# EAGLE schematic escape (EAGLE 9.5.1)
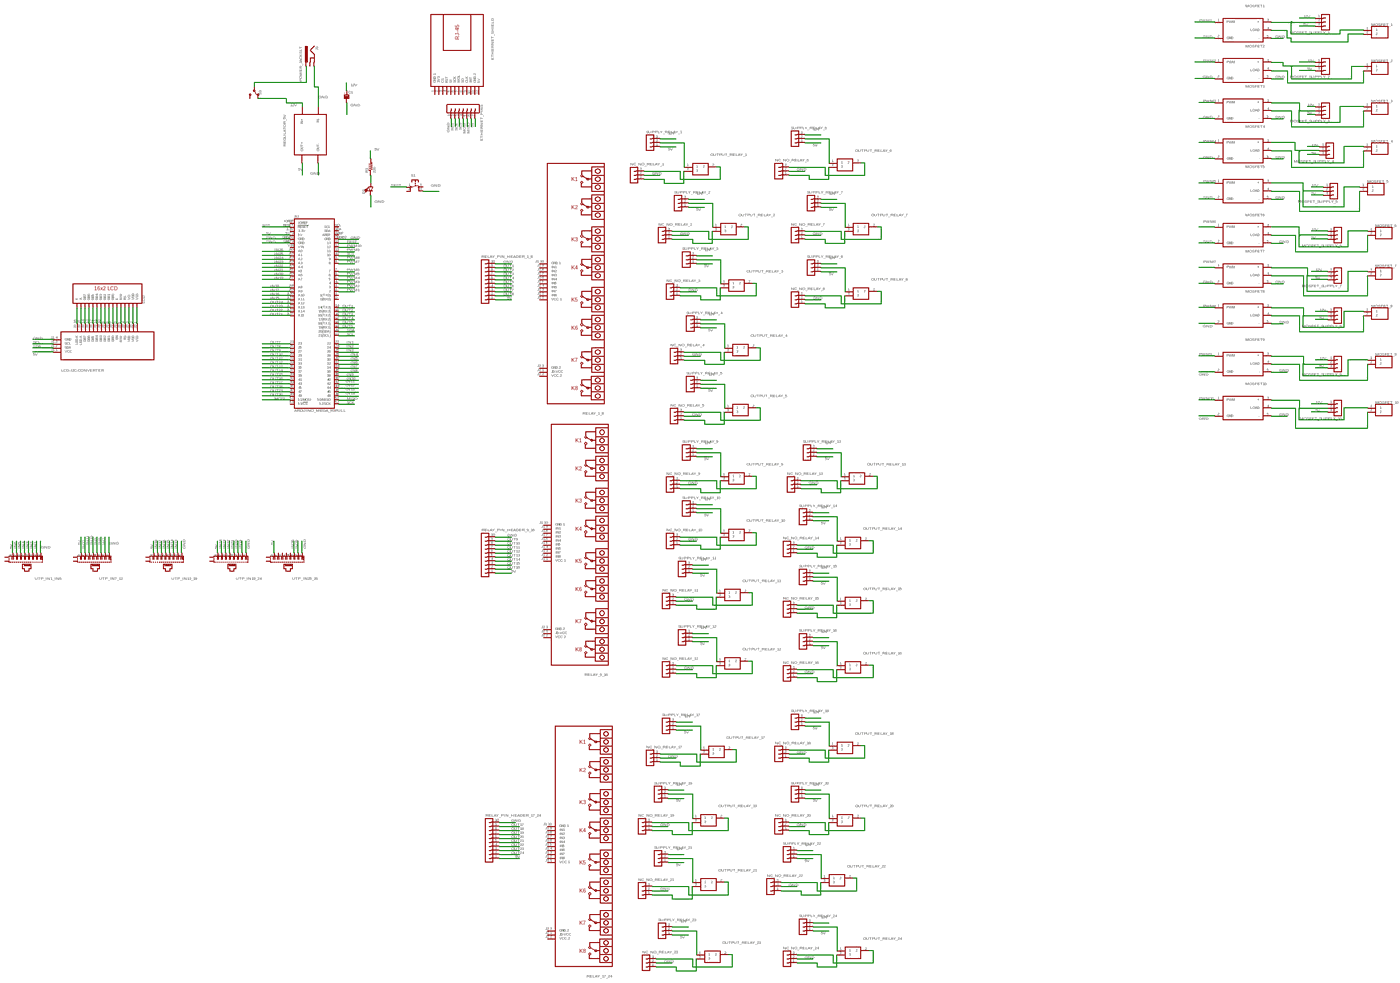
[diagram p0: schematic, sheet 1, overview]
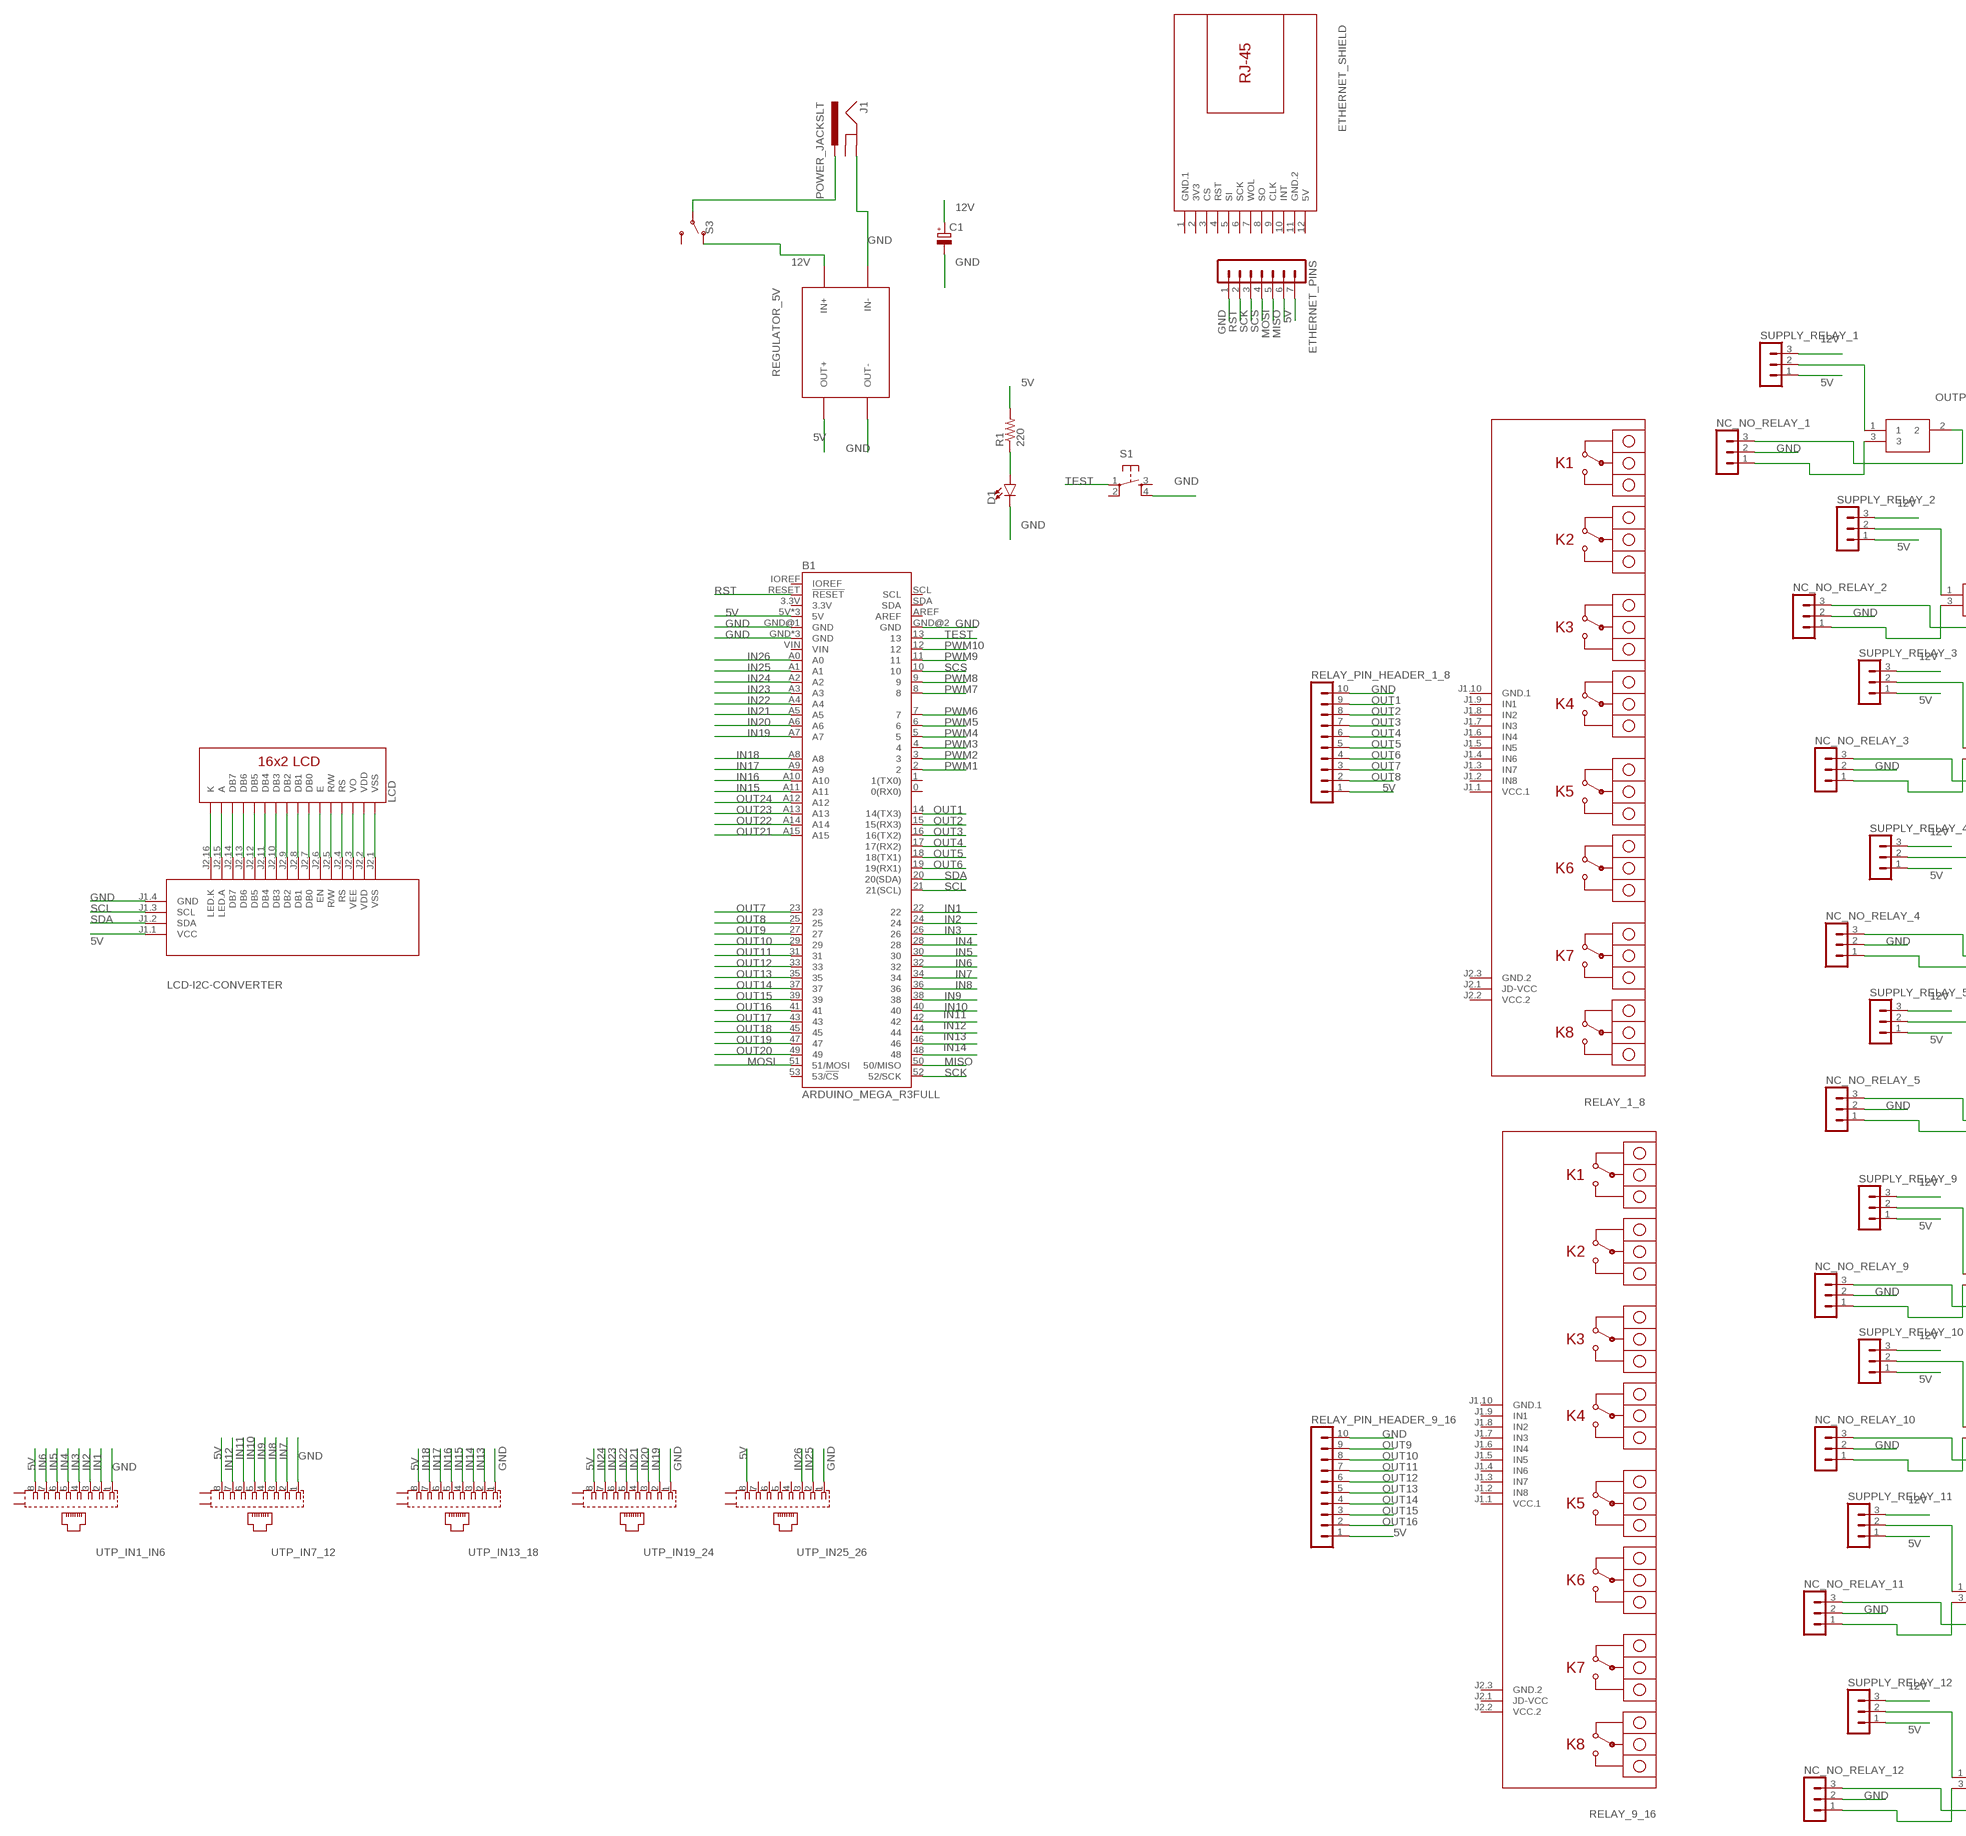
[diagram p1: schematic, sheet 1, part 1 of 4]
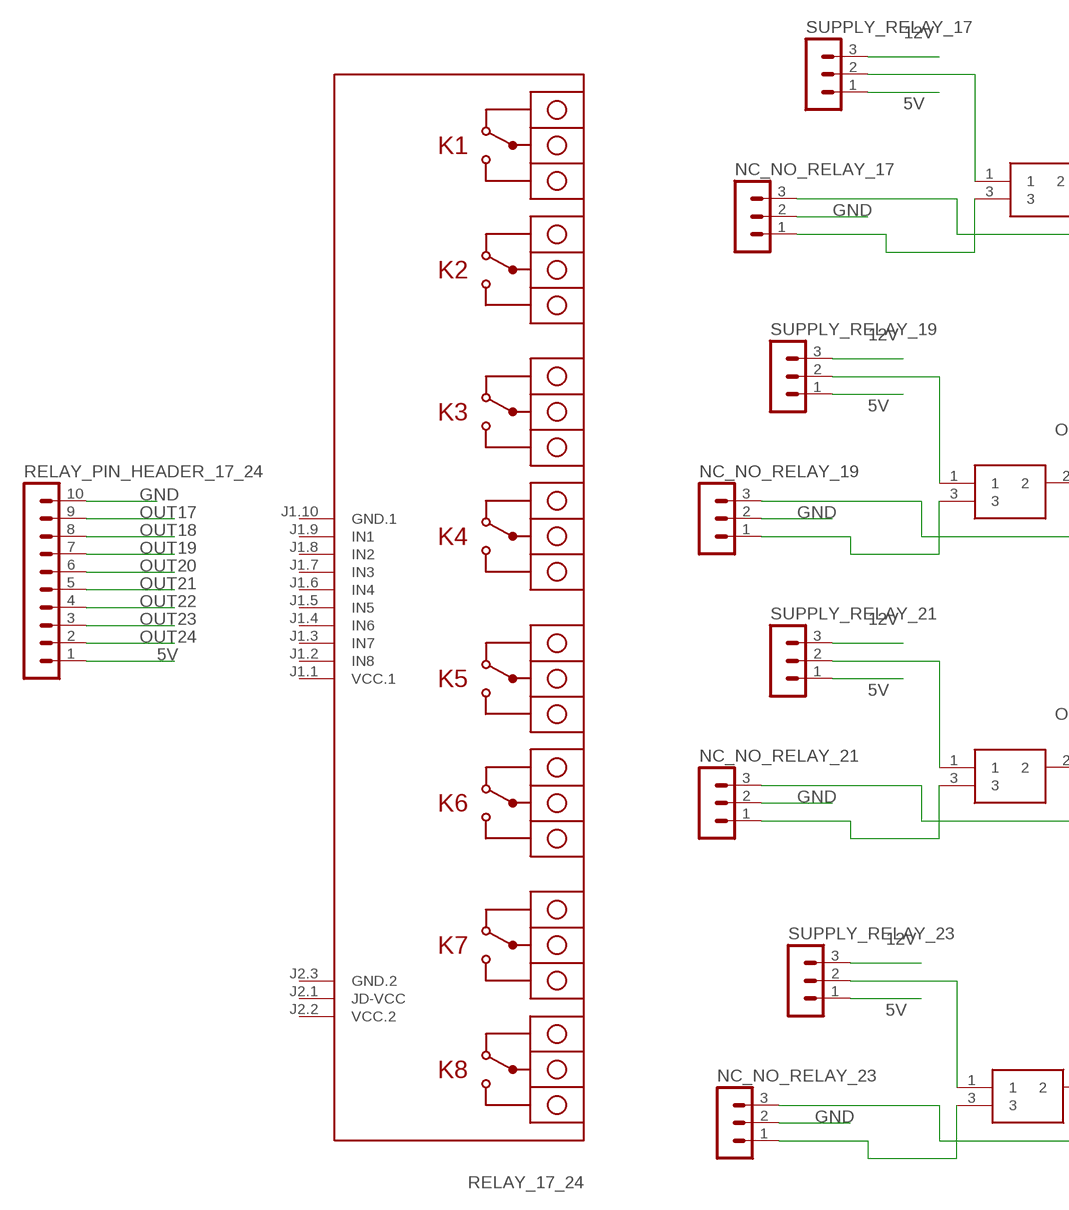
[diagram p2: schematic, sheet 1, part 2 of 4]
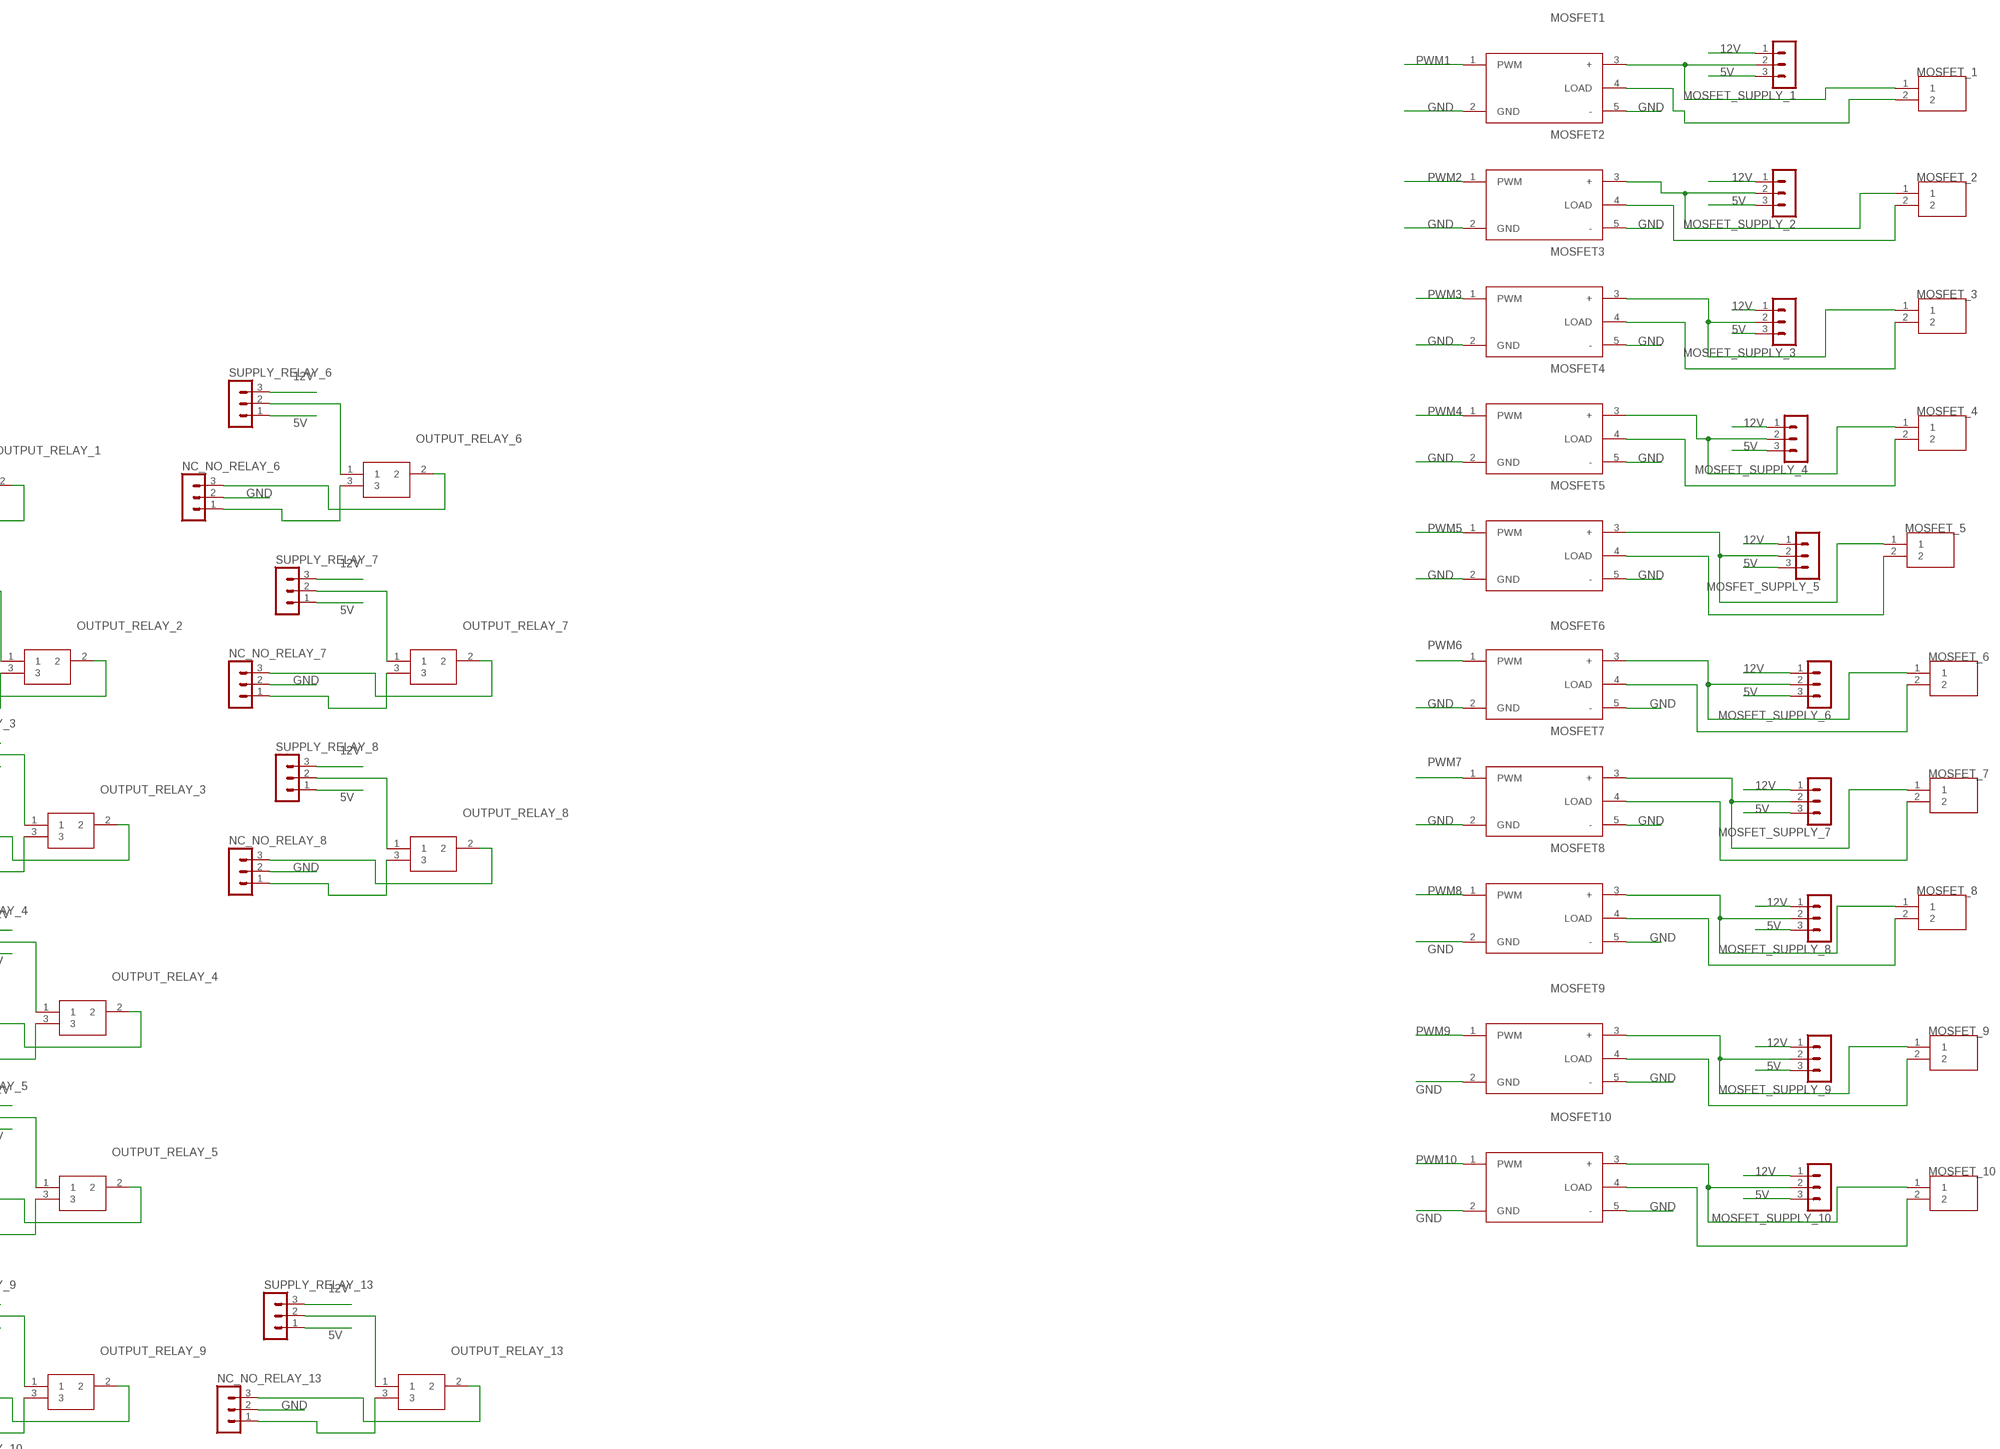
[diagram p3: schematic, sheet 1, part 3 of 4]
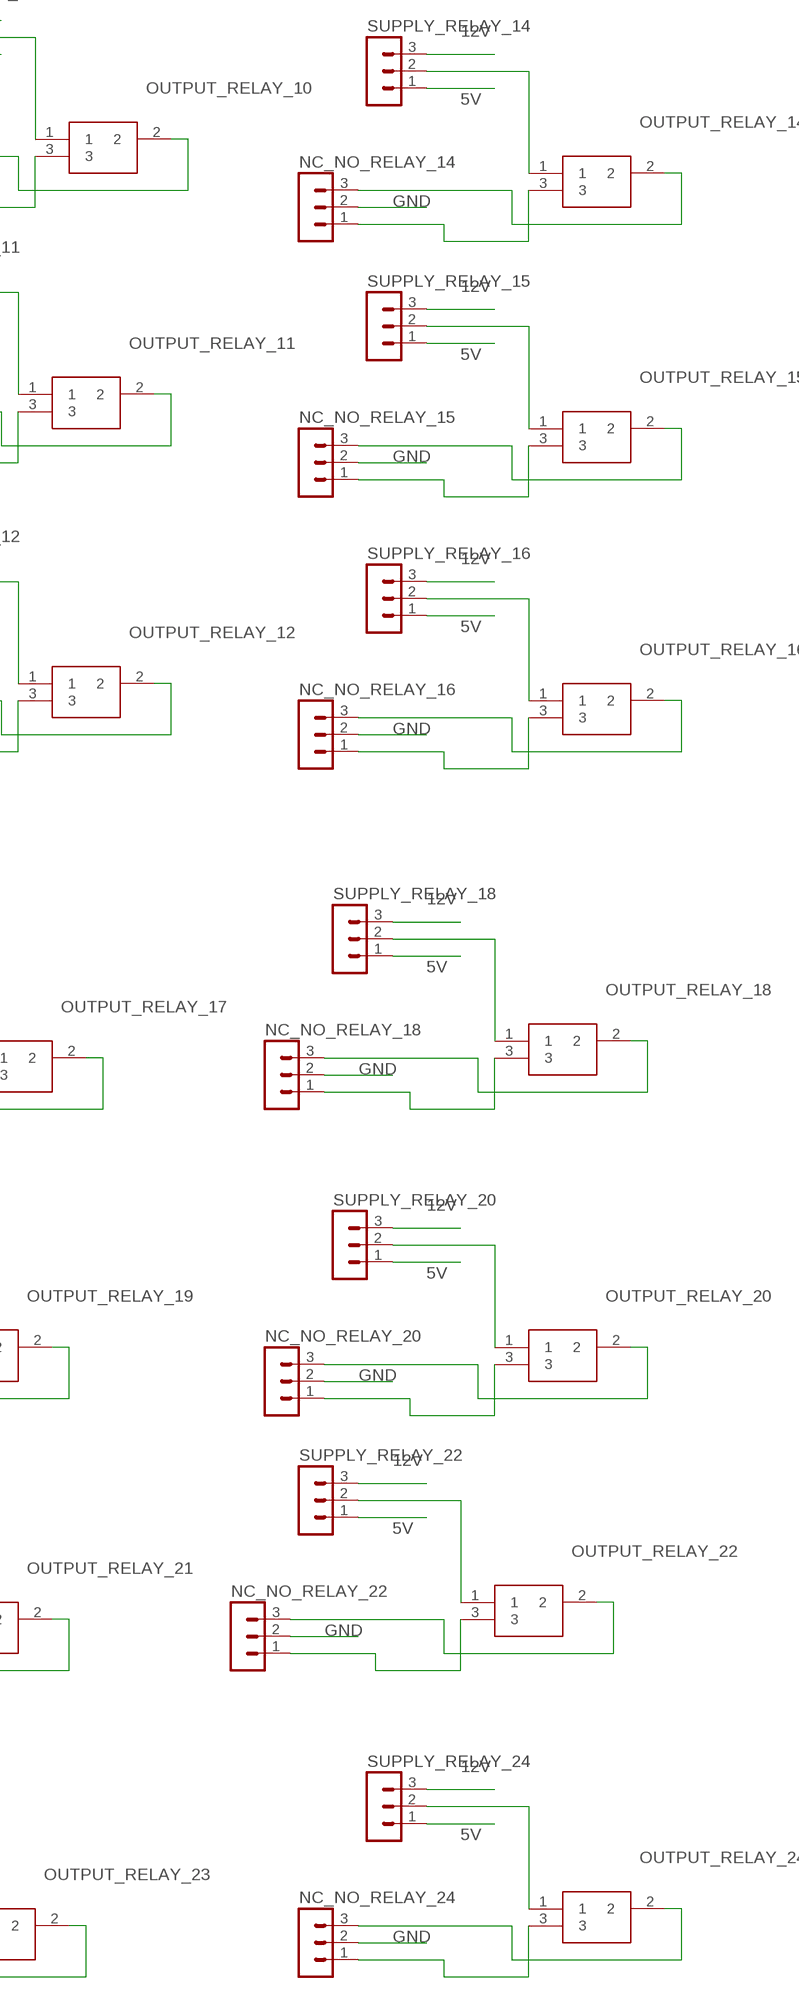
[diagram p4: schematic, sheet 1, part 4 of 4]

## Parts
B1  ARDUINO_MEGA_R3FULL  [ARDUINO_MEGA_NO_SILK]
C1  CPOL-EUE3.5-10  [E3,5-10]
D1  LED5MM  [LED_5MM]
ETHERNET_PINS  MA07-1  [MA07-1]
ETHERNET_SHIELD  ETHERNET-ENC28J60  [ETHERNET-ENC28J60]
J1  POWER_JACKSLT  [POWER_JACK_SLOT]
LCD  LCD-16X2NOSILK  [LCD-16X2_NOSILK]
MOSFET1  SAMACSYS_PARTS_FR120N-ISOLATED-MOSFET-MOD  [SAMACSYS_PARTS_FR120N-ISOLATED-MOSFET-MOD]
MOSFET2  SAMACSYS_PARTS_FR120N-ISOLATED-MOSFET-MOD  [SAMACSYS_PARTS_FR120N-ISOLATED-MOSFET-MOD]
MOSFET3  SAMACSYS_PARTS_FR120N-ISOLATED-MOSFET-MOD  [SAMACSYS_PARTS_FR120N-ISOLATED-MOSFET-MOD]
MOSFET4  SAMACSYS_PARTS_FR120N-ISOLATED-MOSFET-MOD  [SAMACSYS_PARTS_FR120N-ISOLATED-MOSFET-MOD]
MOSFET5  SAMACSYS_PARTS_FR120N-ISOLATED-MOSFET-MOD  [SAMACSYS_PARTS_FR120N-ISOLATED-MOSFET-MOD]
MOSFET6  SAMACSYS_PARTS_FR120N-ISOLATED-MOSFET-MOD  [SAMACSYS_PARTS_FR120N-ISOLATED-MOSFET-MOD]
MOSFET7  SAMACSYS_PARTS_FR120N-ISOLATED-MOSFET-MOD  [SAMACSYS_PARTS_FR120N-ISOLATED-MOSFET-MOD]
MOSFET8  SAMACSYS_PARTS_FR120N-ISOLATED-MOSFET-MOD  [SAMACSYS_PARTS_FR120N-ISOLATED-MOSFET-MOD]
MOSFET9  SAMACSYS_PARTS_FR120N-ISOLATED-MOSFET-MOD  [SAMACSYS_PARTS_FR120N-ISOLATED-MOSFET-MOD]
MOSFET10  SAMACSYS_PARTS_FR120N-ISOLATED-MOSFET-MOD  [SAMACSYS_PARTS_FR120N-ISOLATED-MOSFET-MOD]
MOSFET_1  TB006-508-02BE_TB006-508-02BE  [TB006-508-02BE_CUI_TB006-508-02BE]
MOSFET_2  TB006-508-02BE_TB006-508-02BE  [TB006-508-02BE_CUI_TB006-508-02BE]
MOSFET_3  TB006-508-02BE_TB006-508-02BE  [TB006-508-02BE_CUI_TB006-508-02BE]
MOSFET_4  TB006-508-02BE_TB006-508-02BE  [TB006-508-02BE_CUI_TB006-508-02BE]
MOSFET_5  TB006-508-02BE_TB006-508-02BE  [TB006-508-02BE_CUI_TB006-508-02BE]
MOSFET_6  TB006-508-02BE_TB006-508-02BE  [TB006-508-02BE_CUI_TB006-508-02BE]
MOSFET_7  TB006-508-02BE_TB006-508-02BE  [TB006-508-02BE_CUI_TB006-508-02BE]
MOSFET_8  TB006-508-02BE_TB006-508-02BE  [TB006-508-02BE_CUI_TB006-508-02BE]
MOSFET_9  TB006-508-02BE_TB006-508-02BE  [TB006-508-02BE_CUI_TB006-508-02BE]
MOSFET_10  TB006-508-02BE_TB006-508-02BE  [TB006-508-02BE_CUI_TB006-508-02BE]
MOSFET_SUPPLY_1  MA03-1  [MA03-1]
MOSFET_SUPPLY_2  MA03-1  [MA03-1]
MOSFET_SUPPLY_3  MA03-1  [MA03-1]
MOSFET_SUPPLY_4  MA03-1  [MA03-1]
MOSFET_SUPPLY_5  MA03-1  [MA03-1]
MOSFET_SUPPLY_6  MA03-1  [MA03-1]
MOSFET_SUPPLY_7  MA03-1  [MA03-1]
MOSFET_SUPPLY_8  MA03-1  [MA03-1]
MOSFET_SUPPLY_9  MA03-1  [MA03-1]
MOSFET_SUPPLY_10  MA03-1  [MA03-1]
NC_NO_RELAY_1  MA03-1  [MA03-1]
NC_NO_RELAY_2  MA03-1  [MA03-1]
NC_NO_RELAY_3  MA03-1  [MA03-1]
NC_NO_RELAY_4  MA03-1  [MA03-1]
NC_NO_RELAY_5  MA03-1  [MA03-1]
NC_NO_RELAY_6  MA03-1  [MA03-1]
NC_NO_RELAY_7  MA03-1  [MA03-1]
NC_NO_RELAY_8  MA03-1  [MA03-1]
NC_NO_RELAY_9  MA03-1  [MA03-1]
NC_NO_RELAY_10  MA03-1  [MA03-1]
NC_NO_RELAY_11  MA03-1  [MA03-1]
NC_NO_RELAY_12  MA03-1  [MA03-1]
NC_NO_RELAY_13  MA03-1  [MA03-1]
NC_NO_RELAY_14  MA03-1  [MA03-1]
NC_NO_RELAY_15  MA03-1  [MA03-1]
NC_NO_RELAY_16  MA03-1  [MA03-1]
NC_NO_RELAY_17  MA03-1  [MA03-1]
NC_NO_RELAY_18  MA03-1  [MA03-1]
NC_NO_RELAY_19  MA03-1  [MA03-1]
NC_NO_RELAY_20  MA03-1  [MA03-1]
NC_NO_RELAY_21  MA03-1  [MA03-1]
NC_NO_RELAY_22  MA03-1  [MA03-1]
NC_NO_RELAY_23  MA03-1  [MA03-1]
NC_NO_RELAY_24  MA03-1  [MA03-1]
OUTPUT_RELAY_1  SAMACSYS_PARTS_TB006-508-03BE  [SAMACSYS_PARTS_TB00650803BE]
OUTPUT_RELAY_2  SAMACSYS_PARTS_TB006-508-03BE  [SAMACSYS_PARTS_TB00650803BE]
OUTPUT_RELAY_3  SAMACSYS_PARTS_TB006-508-03BE  [SAMACSYS_PARTS_TB00650803BE]
OUTPUT_RELAY_4  SAMACSYS_PARTS_TB006-508-03BE  [SAMACSYS_PARTS_TB00650803BE]
OUTPUT_RELAY_5  SAMACSYS_PARTS_TB006-508-03BE  [SAMACSYS_PARTS_TB00650803BE]
OUTPUT_RELAY_6  SAMACSYS_PARTS_TB006-508-03BE  [SAMACSYS_PARTS_TB00650803BE]
OUTPUT_RELAY_7  SAMACSYS_PARTS_TB006-508-03BE  [SAMACSYS_PARTS_TB00650803BE]
OUTPUT_RELAY_8  SAMACSYS_PARTS_TB006-508-03BE  [SAMACSYS_PARTS_TB00650803BE]
OUTPUT_RELAY_9  SAMACSYS_PARTS_TB006-508-03BE  [SAMACSYS_PARTS_TB00650803BE]
OUTPUT_RELAY_10  SAMACSYS_PARTS_TB006-508-03BE  [SAMACSYS_PARTS_TB00650803BE]
OUTPUT_RELAY_11  SAMACSYS_PARTS_TB006-508-03BE  [SAMACSYS_PARTS_TB00650803BE]
OUTPUT_RELAY_12  SAMACSYS_PARTS_TB006-508-03BE  [SAMACSYS_PARTS_TB00650803BE]
OUTPUT_RELAY_13  SAMACSYS_PARTS_TB006-508-03BE  [SAMACSYS_PARTS_TB00650803BE]
OUTPUT_RELAY_14  SAMACSYS_PARTS_TB006-508-03BE  [SAMACSYS_PARTS_TB00650803BE]
OUTPUT_RELAY_15  SAMACSYS_PARTS_TB006-508-03BE  [SAMACSYS_PARTS_TB00650803BE]
OUTPUT_RELAY_16  SAMACSYS_PARTS_TB006-508-03BE  [SAMACSYS_PARTS_TB00650803BE]
OUTPUT_RELAY_17  SAMACSYS_PARTS_TB006-508-03BE  [SAMACSYS_PARTS_TB00650803BE]
OUTPUT_RELAY_18  SAMACSYS_PARTS_TB006-508-03BE  [SAMACSYS_PARTS_TB00650803BE]
OUTPUT_RELAY_19  SAMACSYS_PARTS_TB006-508-03BE  [SAMACSYS_PARTS_TB00650803BE]
OUTPUT_RELAY_20  SAMACSYS_PARTS_TB006-508-03BE  [SAMACSYS_PARTS_TB00650803BE]
OUTPUT_RELAY_21  SAMACSYS_PARTS_TB006-508-03BE  [SAMACSYS_PARTS_TB00650803BE]
OUTPUT_RELAY_22  SAMACSYS_PARTS_TB006-508-03BE  [SAMACSYS_PARTS_TB00650803BE]
OUTPUT_RELAY_23  SAMACSYS_PARTS_TB006-508-03BE  [SAMACSYS_PARTS_TB00650803BE]
OUTPUT_RELAY_24  SAMACSYS_PARTS_TB006-508-03BE  [SAMACSYS_PARTS_TB00650803BE]
R1  220  R-US_0207/10  [0207/10]
REGULATOR_5V  DIY-MODULES_DC-DC-STEP-DOWN-LM2596  [DIY-MODULES_DC-DC-STEP-DOWN-LM2596]
RELAY_1_8  RELAY-8-SRD  [RELAY-8-SRD]
RELAY_9_16  RELAY-8-SRD  [RELAY-8-SRD]
RELAY_17_24  RELAY-8-SRD  [RELAY-8-SRD]
RELAY_PIN_HEADER_1_8  MA10-1  [MA10-1]
RELAY_PIN_HEADER_9_16  MA10-1  [MA10-1]
RELAY_PIN_HEADER_17_24  MA10-1  [MA10-1]
S1  TAC_SWITCHPTH  [TACTILE-PTH]
S3  SWITCH-SPDT-PTH-11.6X4.0MM-LOCK  [SWITCH_SPDT_PTH_11.6X4.0MM_LOCK]
SUPPLY_RELAY_1  MA03-1  [MA03-1]
SUPPLY_RELAY_2  MA03-1  [MA03-1]
SUPPLY_RELAY_3  MA03-1  [MA03-1]
SUPPLY_RELAY_4  MA03-1  [MA03-1]
SUPPLY_RELAY_5  MA03-1  [MA03-1]
SUPPLY_RELAY_6  MA03-1  [MA03-1]
SUPPLY_RELAY_7  MA03-1  [MA03-1]
SUPPLY_RELAY_8  MA03-1  [MA03-1]
SUPPLY_RELAY_9  MA03-1  [MA03-1]
SUPPLY_RELAY_10  MA03-1  [MA03-1]
SUPPLY_RELAY_11  MA03-1  [MA03-1]
SUPPLY_RELAY_12  MA03-1  [MA03-1]
SUPPLY_RELAY_13  MA03-1  [MA03-1]
SUPPLY_RELAY_14  MA03-1  [MA03-1]
SUPPLY_RELAY_15  MA03-1  [MA03-1]
SUPPLY_RELAY_16  MA03-1  [MA03-1]
SUPPLY_RELAY_17  MA03-1  [MA03-1]
SUPPLY_RELAY_18  MA03-1  [MA03-1]
SUPPLY_RELAY_19  MA03-1  [MA03-1]
SUPPLY_RELAY_20  MA03-1  [MA03-1]
SUPPLY_RELAY_21  MA03-1  [MA03-1]
SUPPLY_RELAY_22  MA03-1  [MA03-1]
SUPPLY_RELAY_23  MA03-1  [MA03-1]
SUPPLY_RELAY_24  MA03-1  [MA03-1]
U$3  LCD-I2C-CONVERTER  [LCD-I2C-CONVERTER]
UTP_IN1_IN6  GLX-S-88M  [GLX-S-88M]
UTP_IN7_12  GLX-S-88M  [GLX-S-88M]
UTP_IN13_18  GLX-S-88M  [GLX-S-88M]
UTP_IN19_24  GLX-S-88M  [GLX-S-88M]
UTP_IN25_26  GLX-S-88M  [GLX-S-88M]

## Nets
5V: B1.5V B1.5V@1(5V) B1.5V@2(5V) ETHERNET_PINS.7 MOSFET_SUPPLY_1.3 MOSFET_SUPPLY_2.3 MOSFET_SUPPLY_3.3 MOSFET_SUPPLY_4.3 MOSFET_SUPPLY_5.3 MOSFET_SUPPLY_6.3 MOSFET_SUPPLY_7.3 MOSFET_SUPPLY_8.3 MOSFET_SUPPLY_9.3 MOSFET_SUPPLY_10.3 R1.2 REGULATOR_5V.OUT+ RELAY_PIN_HEADER_1_8.1 RELAY_PIN_HEADER_9_16.1 RELAY_PIN_HEADER_17_24.1 SUPPLY_RELAY_1.1 SUPPLY_RELAY_2.1 SUPPLY_RELAY_3.1 SUPPLY_RELAY_4.1 SUPPLY_RELAY_5.1 SUPPLY_RELAY_6.1 SUPPLY_RELAY_7.1 SUPPLY_RELAY_8.1 SUPPLY_RELAY_9.1 SUPPLY_RELAY_10.1 SUPPLY_RELAY_11.1 SUPPLY_RELAY_12.1 SUPPLY_RELAY_13.1 SUPPLY_RELAY_14.1 SUPPLY_RELAY_15.1 SUPPLY_RELAY_16.1 SUPPLY_RELAY_17.1 SUPPLY_RELAY_18.1 SUPPLY_RELAY_19.1 SUPPLY_RELAY_20.1 SUPPLY_RELAY_21.1 SUPPLY_RELAY_22.1 SUPPLY_RELAY_23.1 SUPPLY_RELAY_24.1 U$3.J1.1(VCC) UTP_IN1_IN6.8 UTP_IN7_12.8 UTP_IN13_18.8 UTP_IN19_24.8 UTP_IN25_26.8
12V: C1.+ MOSFET_SUPPLY_1.1 MOSFET_SUPPLY_2.1 MOSFET_SUPPLY_3.1 MOSFET_SUPPLY_4.1 MOSFET_SUPPLY_5.1 MOSFET_SUPPLY_6.1 MOSFET_SUPPLY_7.1 MOSFET_SUPPLY_8.1 MOSFET_SUPPLY_9.1 MOSFET_SUPPLY_10.1 REGULATOR_5V.IN+ S3.1(O) SUPPLY_RELAY_1.3 SUPPLY_RELAY_2.3 SUPPLY_RELAY_3.3 SUPPLY_RELAY_4.3 SUPPLY_RELAY_5.3 SUPPLY_RELAY_6.3 SUPPLY_RELAY_7.3 SUPPLY_RELAY_8.3 SUPPLY_RELAY_9.3 SUPPLY_RELAY_10.3 SUPPLY_RELAY_11.3 SUPPLY_RELAY_12.3 SUPPLY_RELAY_13.3 SUPPLY_RELAY_14.3 SUPPLY_RELAY_15.3 SUPPLY_RELAY_16.3 SUPPLY_RELAY_17.3 SUPPLY_RELAY_18.3 SUPPLY_RELAY_19.3 SUPPLY_RELAY_20.3 SUPPLY_RELAY_21.3 SUPPLY_RELAY_22.3 SUPPLY_RELAY_23.3 SUPPLY_RELAY_24.3
GND: B1.GND B1.GND@1(GND) B1.GND@2(GND) B1.GND@3(GND) B1.GND@4(GND) C1.- D1.K(C) ETHERNET_PINS.1 J1.GND@2(GND) MOSFET1.2(GND) MOSFET1.5(-) MOSFET2.2(GND) MOSFET2.5(-) MOSFET3.2(GND) MOSFET3.5(-) MOSFET4.2(GND) MOSFET4.5(-) MOSFET5.2(GND) MOSFET5.5(-) MOSFET6.2(GND) MOSFET6.5(-) MOSFET7.2(GND) MOSFET7.5(-) MOSFET8.2(GND) MOSFET8.5(-) MOSFET9.2(GND) MOSFET9.5(-) MOSFET10.2(GND) MOSFET10.5(-) NC_NO_RELAY_1.2 NC_NO_RELAY_2.2 NC_NO_RELAY_3.2 NC_NO_RELAY_4.2 NC_NO_RELAY_5.2 NC_NO_RELAY_6.2 NC_NO_RELAY_7.2 NC_NO_RELAY_8.2 NC_NO_RELAY_9.2 NC_NO_RELAY_10.2 NC_NO_RELAY_11.2 NC_NO_RELAY_12.2 NC_NO_RELAY_13.2 NC_NO_RELAY_14.2 NC_NO_RELAY_15.2 NC_NO_RELAY_16.2 NC_NO_RELAY_17.2 NC_NO_RELAY_18.2 NC_NO_RELAY_19.2 NC_NO_RELAY_20.2 NC_NO_RELAY_21.2 NC_NO_RELAY_22.2 NC_NO_RELAY_23.2 NC_NO_RELAY_24.2 REGULATOR_5V.IN- REGULATOR_5V.OUT- RELAY_PIN_HEADER_1_8.10 RELAY_PIN_HEADER_9_16.10 RELAY_PIN_HEADER_17_24.10 S1.4 U$3.J1.4(GND) UTP_IN1_IN6.1 UTP_IN7_12.1 UTP_IN13_18.1 UTP_IN19_24.1 UTP_IN25_26.1
IN1: B1.22 UTP_IN1_IN6.2
IN2: B1.24 UTP_IN1_IN6.3
IN3: B1.26 UTP_IN1_IN6.4
IN4: B1.28 UTP_IN1_IN6.5
IN5: B1.30 UTP_IN1_IN6.6
IN6: B1.32 UTP_IN1_IN6.7
IN7: B1.34 UTP_IN7_12.2
IN8: B1.36 UTP_IN7_12.3
IN9: B1.38 UTP_IN7_12.4
IN10: B1.40 UTP_IN7_12.5
IN11: B1.42 UTP_IN7_12.6
IN12: B1.44 UTP_IN7_12.7
IN13: B1.46 UTP_IN13_18.2
IN14: B1.48 UTP_IN13_18.3
IN15: B1.A11 UTP_IN13_18.4
IN16: B1.A10 UTP_IN13_18.5
IN17: B1.A9 UTP_IN13_18.6
IN18: B1.A8 UTP_IN13_18.7
IN19: B1.A7 UTP_IN19_24.2
IN20: B1.A6 UTP_IN19_24.3
IN21: B1.A5 UTP_IN19_24.4
IN22: B1.A4 UTP_IN19_24.5
IN23: B1.A3 UTP_IN19_24.6
IN24: B1.A2 UTP_IN19_24.7
IN25: B1.A1 UTP_IN25_26.2
IN26: B1.A0 UTP_IN25_26.3
MISO: B1.50(50/MISO) ETHERNET_PINS.6
MOSI: B1.51(51/MOSI) ETHERNET_PINS.5
N$1: OUTPUT_RELAY_1.1 SUPPLY_RELAY_1.2
N$2: D1.A R1.1
N$3: OUTPUT_RELAY_2.1 SUPPLY_RELAY_2.2
N$4: NC_NO_RELAY_1.3 OUTPUT_RELAY_1.2
N$5: NC_NO_RELAY_1.1 OUTPUT_RELAY_1.3
N$6: NC_NO_RELAY_2.3 OUTPUT_RELAY_2.2
N$7: NC_NO_RELAY_2.1 OUTPUT_RELAY_2.3
N$8: OUTPUT_RELAY_3.1 SUPPLY_RELAY_3.2
N$9: NC_NO_RELAY_3.3 OUTPUT_RELAY_3.2
N$10: NC_NO_RELAY_3.1 OUTPUT_RELAY_3.3
N$11: LCD.16(K) U$3.J2.16(LED.K)
N$12: LCD.15(A) U$3.J2.15(LED.A)
N$13: LCD.14(DB7) U$3.J2.14(DB7)
N$14: LCD.13(DB6) U$3.J2.13(DB6)
N$15: LCD.12(DB5) U$3.J2.12(DB5)
N$16: LCD.11(DB4) U$3.J2.11(DB4)
N$17: LCD.10(DB3) U$3.J2.10(DB3)
N$18: LCD.9(DB2) U$3.J2.9(DB2)
N$19: LCD.8(DB1) U$3.J2.8(DB1)
N$20: LCD.7(DB0) U$3.J2.7(DB0)
N$21: LCD.6(E) U$3.J2.6(EN)
N$22: LCD.5(R/W) U$3.J2.5(R/W)
N$23: LCD.4(RS) U$3.J2.4(RS)
N$24: LCD.3(VO) U$3.J2.3(VEE)
N$25: LCD.2(VDD) U$3.J2.2(VDD)
N$26: LCD.1(VSS) U$3.J2.1(VSS)
N$27: OUTPUT_RELAY_9.1 SUPPLY_RELAY_9.2
N$28: OUTPUT_RELAY_4.1 SUPPLY_RELAY_4.2
N$29: NC_NO_RELAY_9.3 OUTPUT_RELAY_9.2
N$30: NC_NO_RELAY_4.3 OUTPUT_RELAY_4.2
N$31: NC_NO_RELAY_4.1 OUTPUT_RELAY_4.3
N$32: OUTPUT_RELAY_5.1 SUPPLY_RELAY_5.2
N$33: NC_NO_RELAY_9.1 OUTPUT_RELAY_9.3
N$34: NC_NO_RELAY_5.3 OUTPUT_RELAY_5.2
N$35: OUTPUT_RELAY_10.1 SUPPLY_RELAY_10.2
N$36: NC_NO_RELAY_5.1 OUTPUT_RELAY_5.3
N$37: OUTPUT_RELAY_6.1 SUPPLY_RELAY_6.2
N$38: NC_NO_RELAY_6.3 OUTPUT_RELAY_6.2
N$39: NC_NO_RELAY_10.3 OUTPUT_RELAY_10.2
N$40: NC_NO_RELAY_6.1 OUTPUT_RELAY_6.3
N$41: NC_NO_RELAY_10.1 OUTPUT_RELAY_10.3
N$42: OUTPUT_RELAY_7.1 SUPPLY_RELAY_7.2
N$43: NC_NO_RELAY_7.3 OUTPUT_RELAY_7.2
N$44: OUTPUT_RELAY_11.1 SUPPLY_RELAY_11.2
N$45: NC_NO_RELAY_11.3 OUTPUT_RELAY_11.2
N$46: NC_NO_RELAY_7.1 OUTPUT_RELAY_7.3
N$47: OUTPUT_RELAY_8.1 SUPPLY_RELAY_8.2
N$48: NC_NO_RELAY_8.3 OUTPUT_RELAY_8.2
N$49: NC_NO_RELAY_11.1 OUTPUT_RELAY_11.3
N$50: NC_NO_RELAY_8.1 OUTPUT_RELAY_8.3
N$51: MOSFET1.3(+) MOSFET_1.1 MOSFET_SUPPLY_1.2
N$52: MOSFET1.4(LOAD) MOSFET_1.2
N$53: MOSFET2.3(+) MOSFET_2.1 MOSFET_SUPPLY_2.2
N$54: MOSFET2.4(LOAD) MOSFET_2.2
N$55: MOSFET3.3(+) MOSFET_3.1 MOSFET_SUPPLY_3.2
N$56: MOSFET3.4(LOAD) MOSFET_3.2
N$57: MOSFET4.3(+) MOSFET_4.1 MOSFET_SUPPLY_4.2
N$58: OUTPUT_RELAY_12.1 SUPPLY_RELAY_12.2
N$59: MOSFET4.4(LOAD) MOSFET_4.2
N$60: NC_NO_RELAY_12.3 OUTPUT_RELAY_12.2
N$61: NC_NO_RELAY_12.1 OUTPUT_RELAY_12.3
N$62: MOSFET5.3(+) MOSFET_5.1 MOSFET_SUPPLY_5.2
N$63: OUTPUT_RELAY_13.1 SUPPLY_RELAY_13.2
N$64: NC_NO_RELAY_13.3 OUTPUT_RELAY_13.2
N$65: MOSFET5.4(LOAD) MOSFET_5.2
N$66: NC_NO_RELAY_13.1 OUTPUT_RELAY_13.3
N$67: OUTPUT_RELAY_14.1 SUPPLY_RELAY_14.2
N$68: MOSFET6.3(+) MOSFET_6.1 MOSFET_SUPPLY_6.2
N$69: NC_NO_RELAY_14.3 OUTPUT_RELAY_14.2
N$70: NC_NO_RELAY_14.1 OUTPUT_RELAY_14.3
N$71: MOSFET6.4(LOAD) MOSFET_6.2
N$72: OUTPUT_RELAY_15.1 SUPPLY_RELAY_15.2
N$73: NC_NO_RELAY_15.3 OUTPUT_RELAY_15.2
N$74: MOSFET7.3(+) MOSFET_7.1 MOSFET_SUPPLY_7.2
N$75: MOSFET7.4(LOAD) MOSFET_7.2
N$76: MOSFET8.3(+) MOSFET_8.1 MOSFET_SUPPLY_8.2
N$77: MOSFET8.4(LOAD) MOSFET_8.2
N$78: MOSFET9.3(+) MOSFET_9.1 MOSFET_SUPPLY_9.2
N$79: MOSFET9.4(LOAD) MOSFET_9.2
N$80: MOSFET10.3(+) MOSFET_10.1 MOSFET_SUPPLY_10.2
N$81: MOSFET10.4(LOAD) MOSFET_10.2
N$82: NC_NO_RELAY_15.1 OUTPUT_RELAY_15.3
N$83: OUTPUT_RELAY_16.1 SUPPLY_RELAY_16.2
N$85: NC_NO_RELAY_16.3 OUTPUT_RELAY_16.2
N$88: NC_NO_RELAY_16.1 OUTPUT_RELAY_16.3
N$91: OUTPUT_RELAY_17.1 SUPPLY_RELAY_17.2
N$94: NC_NO_RELAY_17.3 OUTPUT_RELAY_17.2
N$96: NC_NO_RELAY_17.1 OUTPUT_RELAY_17.3
N$97: OUTPUT_RELAY_18.1 SUPPLY_RELAY_18.2
N$98: NC_NO_RELAY_18.3 OUTPUT_RELAY_18.2
N$99: NC_NO_RELAY_18.1 OUTPUT_RELAY_18.3
N$100: OUTPUT_RELAY_19.1 SUPPLY_RELAY_19.2
N$101: NC_NO_RELAY_19.3 OUTPUT_RELAY_19.2
N$102: NC_NO_RELAY_19.1 OUTPUT_RELAY_19.3
N$103: OUTPUT_RELAY_20.1 SUPPLY_RELAY_20.2
N$104: NC_NO_RELAY_20.3 OUTPUT_RELAY_20.2
N$105: NC_NO_RELAY_20.1 OUTPUT_RELAY_20.3
N$106: OUTPUT_RELAY_21.1 SUPPLY_RELAY_21.2
N$107: NC_NO_RELAY_21.3 OUTPUT_RELAY_21.2
N$108: NC_NO_RELAY_21.1 OUTPUT_RELAY_21.3
N$109: OUTPUT_RELAY_22.1 SUPPLY_RELAY_22.2
N$110: NC_NO_RELAY_22.3 OUTPUT_RELAY_22.2
N$111: NC_NO_RELAY_22.1 OUTPUT_RELAY_22.3
N$112: OUTPUT_RELAY_23.1 SUPPLY_RELAY_23.2
N$113: NC_NO_RELAY_23.3 OUTPUT_RELAY_23.2
N$114: NC_NO_RELAY_23.1 OUTPUT_RELAY_23.3
N$115: OUTPUT_RELAY_24.1 SUPPLY_RELAY_24.2
N$116: NC_NO_RELAY_24.3 OUTPUT_RELAY_24.2
N$117: NC_NO_RELAY_24.1 OUTPUT_RELAY_24.3
N$120: J1.PWR S3.2(P)
OUT1: B1.14(14(TX3)) RELAY_PIN_HEADER_1_8.9
OUT2: B1.15(15(RX3)) RELAY_PIN_HEADER_1_8.8
OUT3: B1.16(16(TX2)) RELAY_PIN_HEADER_1_8.7
OUT4: B1.17(17(RX2)) RELAY_PIN_HEADER_1_8.6
OUT5: B1.18(18(TX1)) RELAY_PIN_HEADER_1_8.5
OUT6: B1.19(19(RX1)) RELAY_PIN_HEADER_1_8.4
OUT7: B1.23 RELAY_PIN_HEADER_1_8.3
OUT8: B1.25 RELAY_PIN_HEADER_1_8.2
OUT9: B1.27 RELAY_PIN_HEADER_9_16.9
OUT10: B1.29 RELAY_PIN_HEADER_9_16.8
OUT11: B1.31 RELAY_PIN_HEADER_9_16.7
OUT12: B1.33 RELAY_PIN_HEADER_9_16.6
OUT13: B1.35 RELAY_PIN_HEADER_9_16.5
OUT14: B1.37 RELAY_PIN_HEADER_9_16.4
OUT15: B1.39 RELAY_PIN_HEADER_9_16.3
OUT16: B1.41 RELAY_PIN_HEADER_9_16.2
OUT17: B1.43 RELAY_PIN_HEADER_17_24.9
OUT18: B1.45 RELAY_PIN_HEADER_17_24.8
OUT19: B1.47 RELAY_PIN_HEADER_17_24.7
OUT20: B1.49 RELAY_PIN_HEADER_17_24.6
OUT21: B1.A15 RELAY_PIN_HEADER_17_24.5
OUT22: B1.A14 RELAY_PIN_HEADER_17_24.4
OUT23: B1.A13 RELAY_PIN_HEADER_17_24.3
OUT24: B1.A12 RELAY_PIN_HEADER_17_24.2
PWM1: B1.2 MOSFET1.1(PWM)
PWM2: B1.3 MOSFET2.1(PWM)
PWM3: B1.4 MOSFET3.1(PWM)
PWM4: B1.5 MOSFET4.1(PWM)
PWM5: B1.6 MOSFET5.1(PWM)
PWM6: B1.7 MOSFET6.1(PWM)
PWM7: B1.8 MOSFET7.1(PWM)
PWM8: B1.9 MOSFET8.1(PWM)
PWM9: B1.11 MOSFET9.1(PWM)
PWM10: B1.12 MOSFET10.1(PWM)
RST: B1.RESET(!RESET) ETHERNET_PINS.2
SCK: B1.52(52/SCK) ETHERNET_PINS.3
SCL: B1.21(21(SCL)) U$3.J1.3(SCL)
SCS: B1.10 ETHERNET_PINS.4
SDA: B1.20(20(SDA)) U$3.J1.2(SDA)
TEST: B1.13 S1.1
Unconnected: B1.0(0(RX0)) B1.1(1(TX0)) B1.3.3V B1.53(53/!CS) B1.AREF B1.IOREF B1.SCL B1.SDA B1.VIN ETHERNET_SHIELD.3(CS) ETHERNET_SHIELD.4(RST) ETHERNET_SHIELD.5(SI) ETHERNET_SHIELD.6(SCK) ETHERNET_SHIELD.7(WOL) ETHERNET_SHIELD.8(SO) ETHERNET_SHIELD.9(CLK) ETHERNET_SHIELD.10(INT) J1.GND@1(GNDBREAK) RELAY_1_8.J1.2(IN8) RELAY_1_8.J1.3(IN7) RELAY_1_8.J1.4(IN6) RELAY_1_8.J1.5(IN5) RELAY_1_8.J1.6(IN4) RELAY_1_8.J1.7(IN3) RELAY_1_8.J1.8(IN2) RELAY_1_8.J1.9(IN1) RELAY_1_8.J2.1(JD-VCC) RELAY_9_16.J1.2(IN8) RELAY_9_16.J1.3(IN7) RELAY_9_16.J1.4(IN6) RELAY_9_16.J1.5(IN5) RELAY_9_16.J1.6(IN4) RELAY_9_16.J1.7(IN3) RELAY_9_16.J1.8(IN2) RELAY_9_16.J1.9(IN1) RELAY_9_16.J2.1(JD-VCC) RELAY_17_24.J1.2(IN8) RELAY_17_24.J1.3(IN7) RELAY_17_24.J1.4(IN6) RELAY_17_24.J1.5(IN5) RELAY_17_24.J1.6(IN4) RELAY_17_24.J1.7(IN3) RELAY_17_24.J1.8(IN2) RELAY_17_24.J1.9(IN1) RELAY_17_24.J2.1(JD-VCC) S1.2 S1.3 S3.3(S) UTP_IN1_IN6.S1 UTP_IN1_IN6.S2 UTP_IN7_12.S1 UTP_IN7_12.S2 UTP_IN13_18.S1 UTP_IN13_18.S2 UTP_IN19_24.S1 UTP_IN19_24.S2 UTP_IN25_26.4 UTP_IN25_26.5 UTP_IN25_26.6 UTP_IN25_26.7 UTP_IN25_26.S1 UTP_IN25_26.S2

## Power pins joined to a net without a drawn wire
3V3: ETHERNET_SHIELD.2(3V3)
5V: ETHERNET_SHIELD.12(5V)
GND.1: ETHERNET_SHIELD.1(GND.1) RELAY_1_8.J1.10(GND.1) RELAY_9_16.J1.10(GND.1) RELAY_17_24.J1.10(GND.1)
GND.2: ETHERNET_SHIELD.11(GND.2) RELAY_1_8.J2.3(GND.2) RELAY_9_16.J2.3(GND.2) RELAY_17_24.J2.3(GND.2)
VCC.1: RELAY_1_8.J1.1(VCC.1) RELAY_9_16.J1.1(VCC.1) RELAY_17_24.J1.1(VCC.1)
VCC.2: RELAY_1_8.J2.2(VCC.2) RELAY_9_16.J2.2(VCC.2) RELAY_17_24.J2.2(VCC.2)

## Library data of the parts
B1 = SparkFun-Boards:ARDUINO_MEGA_R3: Arduino Mega R3 ATmega2560 R3 compatible footprint. SparkFun Products: Arduino Mega 2560 R3 <https://www.sparkfun.com/products/11061>
C1 = rcl:CPOL-EU: POLARIZED CAPACITOR, European symbol; SPICEPREFIX: C
D1 = SparkFun-LED:LED: LED (Generic) Standard schematic elements and footprints for 5mm, 3mm, 1206, and 0603 sized LEDs. Generic LEDs with no color specified.
ETHERNET_PINS = con-lstb:MA07-1: PIN HEADER; OC_FARNELL: unknown; OC_NEWARK: unknown
ETHERNET_SHIELD = diy-modules:ETHERNET-ENC28J60: Ethernet Module based on ENC28J60 chip Click here to find device on ebay.com <http://www.ebay.com/sch/end28j60+ethernet+lan+module> Note: There are many variants. Search for the proper version.
J1 = SparkFun-Connectors:POWER_JACK: Power Jack Connector This is the standard 5.5mm barrel jack for power. The PTH is the most common, proven, reliable, footprint. The Slot footprint only works if the mill layer is transmitted to the PCB fab house so be warned. Here are the connectors we sell at SparkFun: DC Barrel Power Jack/Connector <https://www.sparkfun.com/products/119> (PRT-00119) DC Barrel Power Jack/Connector (SMD) <https://www.sparkfun.com/products/12748> (PRT-12748) DC Barrel Jack Adapter - Breadboard Compatible <https://www.sparkfun.com/products/10811> (PRT-10811) It is used on this SparkFun product (and many, many others): SparkFun RedBoard - Programmed with Arduino <https://www.sparkfun.com/products/12757> (DEV-12757) Also, if you need a mating power supply or connector, please check these out: Wall Adapter Power Supply - 9VDC 650mA <https://www.sparkfun.com/products/298> (TOL-00298) DC Barrel Jack Adapter - Male <https://www.sparkfun.com/products/10287> (PRT-10287); PROD_ID: PRT-00119
LCD = SparkFun-Displays:LCD-16X2: Standard text-only 16x2 parallel input LCD Basic 16 character by 2 line display. Typically utilizes the extremely common HD44780 parallel interface chipset SparkFun Products: Basic 16x2 Green <https://www.sparkfun.com/products/255> Basic 8x2 Green <https://www.sparkfun.com/products/11122>; SF_ID: LCD-00255
MOSFET1-MOSFET10 = palames:SAMACSYS_PARTS_FR120N-ISOLATED-MOSFET-MOD
MOSFET_1-MOSFET_10 = palames:TB006-508-02BE_TB006-508-02BE; AVAILABILITY: Unavailable; CUI_PURCHASE_URL: https://www.cuidevices.com/product/interconnect/connectors/terminal-blocks/tb006-508-series?utm_source=snapeda.com&utm_medium=referral&utm_campaign=snapedaBOM; DESCRIPTION: 2~24 Poles, Screw Type, Horizontal, 5.08 Pitch, 26~14 _AWG_, Terminal Block Connector; MF: CUI Devices; MP: TB006-508-02BE; PACKAGE: None; PRICE: None
MOSFET_SUPPLY_1-MOSFET_SUPPLY_10 NC_NO_RELAY_1-NC_NO_RELAY_24 SUPPLY_RELAY_1-SUPPLY_RELAY_24 = con-lstb:MA03-1: PIN HEADER; OC_FARNELL: unknown; OC_NEWARK: unknown
OUTPUT_RELAY_1-OUTPUT_RELAY_24 = palames:SAMACSYS_PARTS_TB006-508-03BE: Fixed Terminal Blocks screw type, 5.08 , horizontal, 3 poles, CUI Blue, slotted screw, PCB mount Source: Datasheet <https://componentsearchengine.com/Datasheets/1/TB006-508-03BE.pdf>; DESCRIPTION: Fixed Terminal Blocks screw type, 5.08 , horizontal, 3 poles, CUI Blue, slotted screw, PCB mount; HEIGHT: 10.4mm; MANUFACTURER_NAME: CUI; MANUFACTURER_PART_NUMBER: TB006-508-03BE; MOUSER_PART_NUMBER: 490-TB006-508-03BE; MOUSER_PRICE-STOCK: https://www.mouser.com/Search/Refine.aspx?Keyword=490-TB006-508-03BE
R1 = rcl:R-US_: RESISTOR, American symbol; SPICEPREFIX: R
REGULATOR_5V = palames:DIY-MODULES_DC-DC-STEP-DOWN-LM2596: DC/DC Step-Down Regulator based on LM2596-ADJ chip LM2596 datasheet available here: http://www.ti.com/lit/ds/symlink/lm2596.pdf Click here to find device on ebay.com <http://www.ebay.com/sch/lm2596+power+regulator>
RELAY_1_8 RELAY_9_16 RELAY_17_24 = diy-modules:RELAY-8-SRD: 8-Channel Relay Module based on SRD-05VDC-SL-C relays Click here to find device on ebay.com <http://www.ebay.com/sch/eight+channel+relay+module+optocoupler+5v>
RELAY_PIN_HEADER_1_8 RELAY_PIN_HEADER_9_16 RELAY_PIN_HEADER_17_24 = con-lstb:MA10-1: PIN HEADER; OC_FARNELL: unknown; OC_NEWARK: unknown
S1 = SparkFun-Retired:TAC_SWITCH: Momentary Switch Button commonly used for reset or general input. Spark Fun Electronics SKU : COM-00097 SMT- SWCH-08247
S3 = SparkFun-Switches:SWITCH-SPDT: Single Pole, Double Throw (SPDT) Switch Single-pole, double-throw (SPDT) switch. Variant Overview SMD-AYZ0202 Surface Mount DPDT Switch <https://www.sparkfun.com/products/597> (COM-00597) Used on e.g. LilyPad Arduino USB - ATmega32U4 Board <https://www.sparkfun.com/products/12049> PTH-11.6X4.0MM SPDT Mini Power Switch <https://www.sparkfun.com/products/102> (COM-00102) Used on e.g. SparkFun Simon Says - Through-Hole Soldering Kit <https://www.sparkfun.com/products/10547> (KIT-10547) PTH-11.6X4.0MM-KIT KIT version of SPDT Mini Power Switch - Simplifies soldering by removing tStop of switch pins - only one side can be soldered. PTH-11.6X4.0MM-LOCK LOCK version of SPDT Mini Power Switch - Offset pins hold switch in place for easier soldering. SMD-RIGHT-ANGLE Surface Mount Right Angle Switch <https://www.sparkfun.com/products/10860> (COM-10860) Used on e.g. SparkFun ESP8266 Thing <https://www.sparkfun.com/products/13231>; PROD_ID: SWCH-08261; SF_SKU: COM-00102
U$3 = diy-modules:LCD-I2C-CONVERTER: I2C Bus to 4-Bit Parallel LCD Interface with LED backlight driver
UTP_IN1_IN6 UTP_IN7_12 UTP_IN13_18 UTP_IN19_24 UTP_IN25_26 = con-kycon:GLX-S-88M: Mod. Jack, Right Angle, 8 posiotion, 8 contatcs RJ45 Source: GLX-S-88M.pdf; OC_FARNELL: unknown; OC_NEWARK: unknown